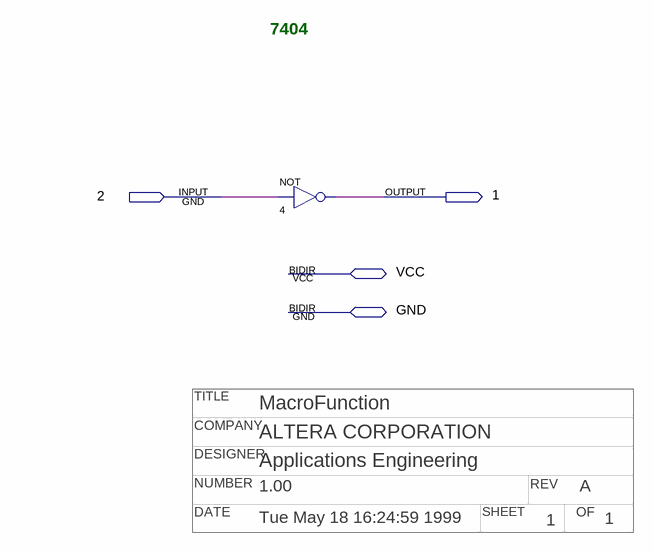
[diagram p0: schematic sheet]
// Quartus schematic np7404.bdf as structural Verilog: 1 symbols, 4 pins
// Title block: TITLE: MacroFunction; COMPANY: ALTERA CORPORATION; DESIGNER: Applications Engineering; NUMBER: 1.00; REV: A; DATE: Tue May 18 16:24:59 1999; SHEET: 1; OF: 1
module np7404 (
  input  \2 ,
  inout  VCC,
  inout  GND,
  output \1 
);

  not u_4 (\1 , \2 );

  // Notes on the sheet:
  //   7404
endmodule
